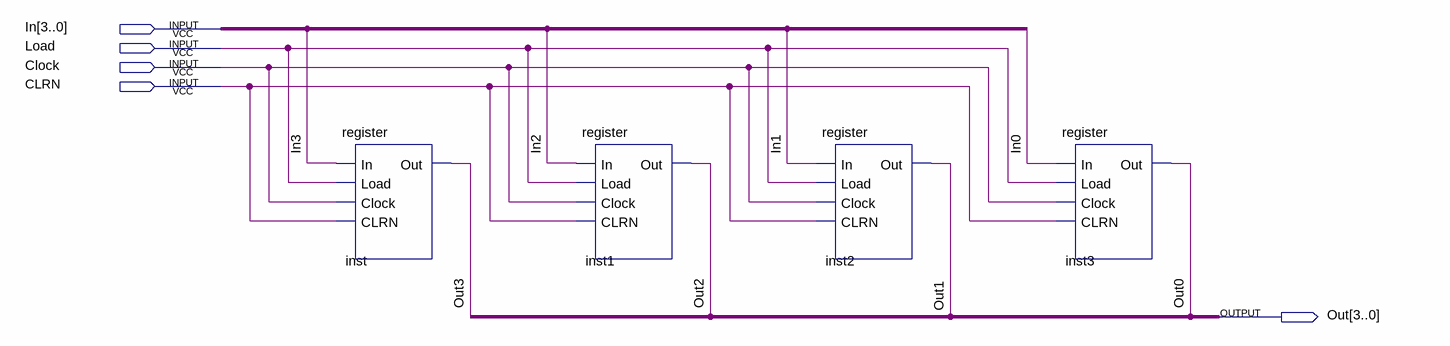
[diagram p0: schematic sheet]
// Quartus schematic reg4b.bdf as structural Verilog: 4 symbols, 5 pins
module reg4b (
  input  [3:0] In,
  input  Load,
  input  Clock,
  input  CLRN,
  output [3:0] Out
);

  register inst (.In(In[3]), .Load(Load), .Clock(Clock), .CLRN(CLRN), .Out(Out[3]));
  register inst1 (.In(In[2]), .Load(Load), .Clock(Clock), .CLRN(CLRN), .Out(Out[2]));
  register inst2 (.In(In[1]), .Load(Load), .Clock(Clock), .CLRN(CLRN), .Out(Out[1]));
  register inst3 (.In(In[0]), .Load(Load), .Clock(Clock), .CLRN(CLRN), .Out(Out[0]));
endmodule
